# Altium schematic sheet Sync Demod.SchDoc: Sync Demod
size OrCAD A; DocumentNumber: LM-003; Revision: 3.0; SheetNumber: 5; SheetTotal: 11
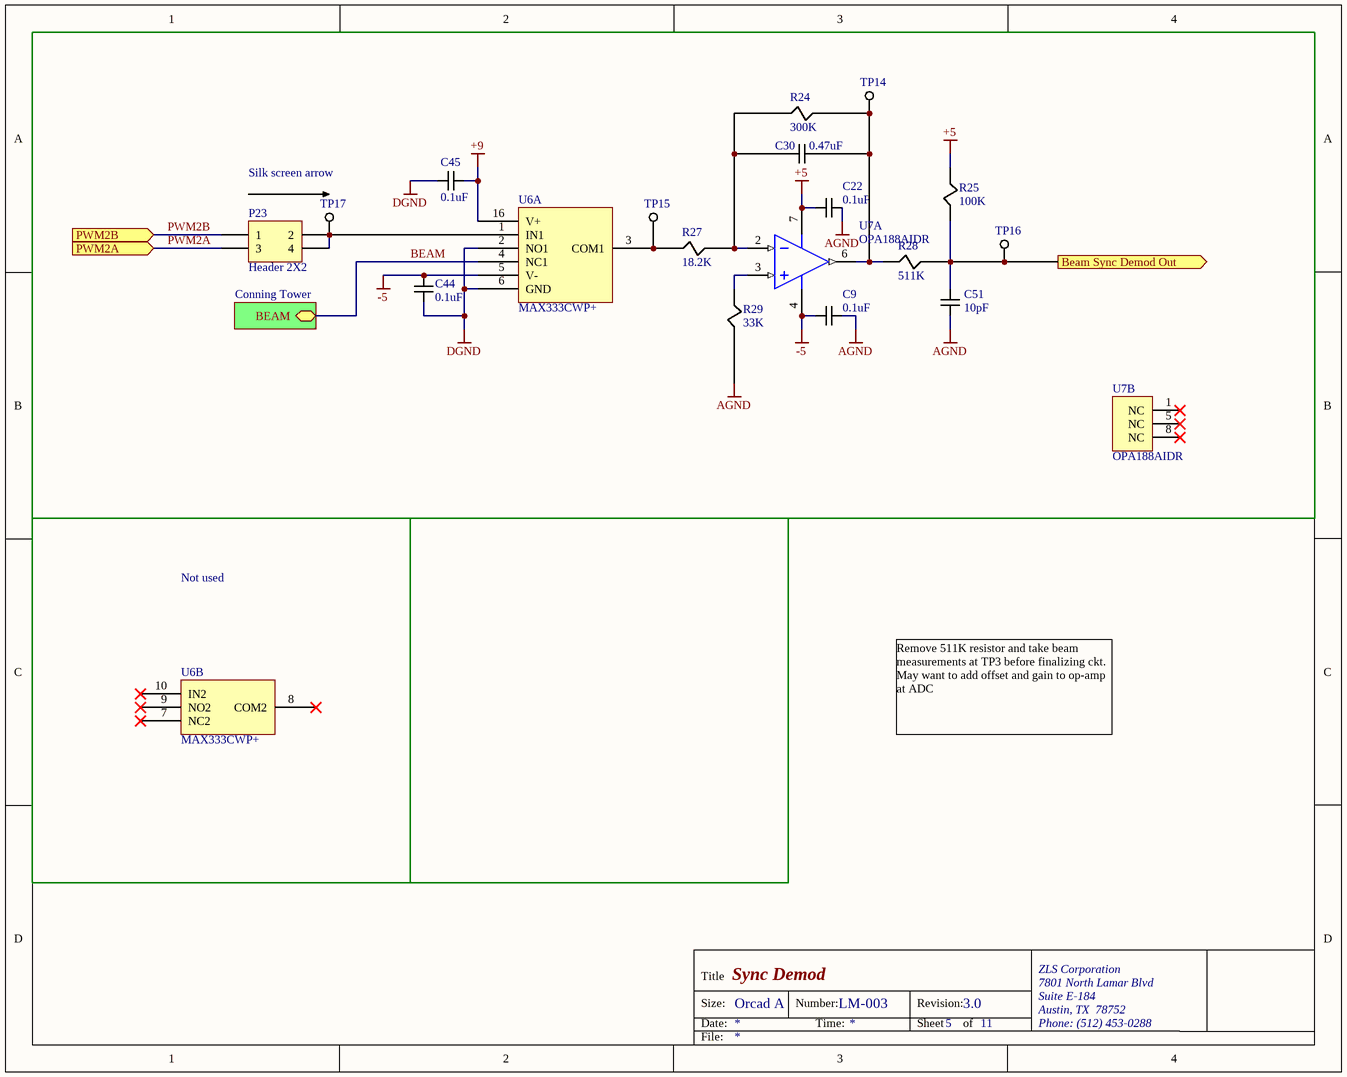
[diagram p0: Sync Demod.SchDoc]

## Parts
(Parts that share a designator on the sheet are numbered #1, #2 ... from top to bottom, then left to right.)
C9  0.1uF
C22  0.1uF
C30  0.47uF
C44  0.1uF
C45  0.1uF
C51  10pF
P23  Header 2X2  [HDR2X2]
R24  300K  [0805]
R25  100K  [0805]
R27  18.2K  [0805]
R28  511K  [0805]
R29  33K  [0805]
TP14  (no value)
TP15  (no value)
TP16  (no value)
TP17  (no value)
U6  MAX333CWP+  (parts A,B of 4)
U7#1  OPA188AIDR  [D0008A_M]  (part A of 2)
U7#2  OPA188AIDR  [D0008A_M]  (part B of 2)

## Blocks framed on the sheet
Silk screen arrow: C9 C22 C30 C44 C45 C51 P23 R24 R25 R27-R29 TP14-TP17 U6 U7#1 U7#2
Not used: U6

## Sub-sheets
Conning Tower = Connectors.SchDoc: BEAM

## Ports
Beam Sync Demod Out (out), PWM2A (in), PWM2B (in)

## Nets
+5: C22.1 R25.2 U7#1.7(V+)
+9: C45.2 U6.16(V+)
-5: C9.1 C44.1 U6.5(V-) U7#1.4(V-)
AGND: C9.2 C22.2 C51.2 R29.1
DGND: C44.2 C45.1 U6.2(NO1) U6.6(GND)
BEAM: U6.4(NC1) ; sheet Conning Tower/BEAM
Beam Sync Demod Out: C51.1 R25.1 R28.2 TP16.1 ; port Beam Sync Demod Out
PWM2A: P23.3 ; port PWM2A
PWM2B: P23.1 ; port PWM2B
NetC30_1: C30.1 R24.1 R27.2 U7#1.2(IN-)
NetC30_2: C30.2 R24.2 R28.1 TP14.1 U7#1.6(OUT)
NetP23_2: P23.2 P23.4 TP17.1 U6.1(IN1)
NetR27_1: R27.1 TP15.1 U6.3(COM1)
NetR29_2: R29.2 U7#1.3(IN+)

Not connected (* = marked no-connect by the designer): U6 7(NC2)* 8(COM2)* 9(NO2)* 10(IN2)*; U7#2 1(NC)* 5(NC)* 8(NC)*

## Notes on the sheet
- Remove 511K resistor and take beam measurements at TP3 before finalizing ckt.
  May want to add offset and gain to op-amp at ADC
- Title
- Size:
- Date:
- Orcad A
- Number:
- Time:
- Revision:
- Sheet
- of
- ZLS Corporation
- 7801 North Lamar Blvd
- Suite E-184
- Austin, TX  78752
- Phone: (512) 453-0288
- File:

## Library data of the parts
C9 C22 C44 C45 = CAP B: CAP CER 0.1UF 25V X7R 0805; Manufacturer 1: Murata Electronics North America; Manufacturer Part Number 1: GRM21BR71E104KA01L; Category 1: Capacitors; Capacitance: 0.1µF; Tolerance: ±10%; Supplier 1: Digi-Key; Supplier Part Number 1: 490-1673-1-ND; RoHS 1: RoHS Compliant; Description 1: CAP CER 0.1UF 25V X7R 0805; Stock 1: 897437; Pricing 1: 1=0.2, 10=0.145, 25=0.106, 50=0.0824, 100=0.0683, 250=0.05652, 500=0.04788, 1000=0.03964 (USD); Packaging: Cut Tape (CT); Part Status: Active; Voltage - Rated: 25V; Temperature Coefficient: X7R; Operating Temperature: -55°C ~ 125°C; Features: -; Ratings: -; Applications: General Purpose; Mounting Type: Surface Mount, MLCC; Package / Case: 0805 (2012 Metric); Size / Dimension: 0.079" L x 0.049" W (2.00mm x 1.25mm); Height - Seated (Max): -; Thickness (Max): 0.053" (1.35mm); Lead Spacing: -; Lead Style: -; ComponentLink1URL: http://www.murata.com/~/media/webrenewal/support/library/catalog/products/capacitor/mlcc/c02e.ashx; ComponentLink1Description: http://www.murata.com/~/media/webrenewal/support/library/catalog/products/capacitor/mlcc/c02e.ashx
C30 = CAP B: CAP CER 0.47UF 25V X7R 0805; Manufacturer 1: Murata Electronics North America; Manufacturer Part Number 1: GRM219R71E474KA88D; Category 1: Capacitors; Capacitance: 0.47µF; Tolerance: ±10%; Supplier 1: Digi-Key; Supplier Part Number 1: 490-11584-1-ND; RoHS 1: RoHS Compliant; Description 1: CAP CER 0.47UF 25V X7R 0805; Stock 1: 32625; Pricing 1: 1=0.31, 10=0.219, 25=0.1792, 50=0.153, 100=0.1311, 250=0.10924, 500=0.09832, 1000=0.08303 (USD); Packaging: Cut Tape (CT); Part Status: Active; Voltage - Rated: 25V; Temperature Coefficient: X7R; Operating Temperature: -55°C ~ 125°C; Features: -; Ratings: -; Applications: General Purpose; Mounting Type: Surface Mount, MLCC; Package / Case: 0805 (2012 Metric); Size / Dimension: 0.079" L x 0.049" W (2.00mm x 1.25mm); Height - Seated (Max): -; Thickness (Max): 0.037" (0.95mm); Lead Spacing: -; Lead Style: -; ComponentLink1URL: http://www.murata.com/~/media/webrenewal/support/library/catalog/products/capacitor/mlcc/c02e.ashx; ComponentLink1Description: http://www.murata.com/~/media/webrenewal/support/library/catalog/products/capacitor/mlcc/c02e.ashx
C51 = CAP B: CAP CER 10PF 200V C0G/NP0 0805; Manufacturer 1: Murata Electronics North America; Manufacturer Part Number 1: GRM21A5C2D100JW01D; Category 1: Capacitors; Tolerance: ±5%; Temperature Coefficient: C0G, NP0; Supplier 1: Digi-Key; Supplier Part Number 1: 490-14649-1-ND; RoHS 1: RoHS Compliant; Description 1: CAP CER 10PF 200V C0G/NP0 0805; Stock 1: 1350; Pricing 1: 1=0.29, 10=0.196, 25=0.1436, 50=0.1174, 100=0.0991, 250=0.08084, 500=0.06782, 1000=0.05999 (USD); Part Status: Active; Capacitance: 10pF; Voltage - Rated: 200V; Operating Temperature: -55°C ~ 125°C; Features: -; Ratings: -; Applications: General Purpose; Failure Rate: -; Mounting Type: Surface Mount, MLCC; Package / Case: 0805 (2012 Metric); Size / Dimension: 0.079" L x 0.049" W (2.00mm x 1.25mm); Height - Seated (Max): -; Thickness (Max): 0.039" (1.00mm); Lead Spacing: -; Lead Style: -; ComponentLink1URL: http://search.murata.co.jp/Ceramy/image/img/A01X/G101/ENG/GRM21A5C2D100JW01-01.pdf; ComponentLink1Description: http://search.murata.co.jp/Ceramy/image/img/A01X/G101/ENG/GRM21A5C2D100JW01-01.pdf
P23 = Header 2X2: Header, 2-Pin, Dual row; Manufacturer 1: TE Connectivity AMP Connectors; Manufacturer Part Number 1: 1-87215-0; Description 1: CONN HEADER VERT 2POS .100 30AU; Category 1: Connectors, Interconnects; Style: Board to Board or Cable; Shrouding: Unshrouded; Number of Positions: 2; Number of Positions Loaded: All; Row Spacing - Mating: 0.100" (2.54mm); Contact Length - Mating: 0.318" (8.08mm); Contact Length - Post: 0.125" (3.18mm); Overall Contact Length: 0.533" (13.55mm); Material Flammability Rating: UL94 V-0; Current Rating: 3A; Supplier 1: Digi-Key; Supplier Part Number 1: A26564-ND; RoHS 1: RoHS Compliant; Stock 1: 9703; Pricing 1: 1=1.42, 10=1.287, 50=1.1554, 100=1.1029, 250=0.99784, 500=0.91906, 1000=0.78777, 2500=0.73525 (USD); Packaging: Bulk; Part Status: Active; Connector Type: Header; Contact Type: Male Pin; Pitch - Mating: -; Number of Rows: 2; Mounting Type: Through Hole; Termination: Solder; Fastening Type: Push-Pull; Insulation Height: 0.090" (2.29mm); Contact Shape: Circular; Contact Finish - Mating: Gold; Contact Finish Thickness - Mating: 30µin (0.76µm); Contact Finish - Post: Gold; Contact Material: Phosphor Bronze; Insulation Material: Thermoplastic; Features: -; Operating Temperature: -65°C ~ 105°C; Ingress Protection: -; Insulation Color: Black; Voltage Rating: -; Mated Stacking Heights: -; Contact Finish Thickness - Post: Flash; Applications: -; ComponentLink1URL: http://www.te.com/commerce/DocumentDelivery/DDEController?Action=srchrtrv&DocNm=87215&DocType=Customer+Drawing&DocLang=English; ComponentLink1Description: http://www.te.com/commerce/DocumentDelivery/DDEController?Action=srchrtrv&DocNm=87215&DocType=Customer+Drawing&DocLang=English
R24 = RES1: RES SMD 300K OHM 1% 1/8W 0805; Manufacturer 1: Vishay Dale; Manufacturer Part Number 1: CRCW0805300KFKEA; Category 1: Resistors; Power (Watts): 0.125W, 1/8W; Temperature Coefficient: ±100ppm/°C; Supplier 1: Digi-Key; Supplier Part Number 1: 541-300KCDKR-ND; RoHS 1: RoHS Compliant; Description 1: RES SMD 300K OHM 1% 1/8W 0805; Stock 1: 30792; Pricing 1: 1=0.1, 10=0.042, 25=0.0304, 50=0.0232, 100=0.017, 250=0.013, 500=0.0104, 1000=0.00765 (USD); Packaging: Digi-Reel®; Part Status: Active; Resistance (Ohms): 300k; Tolerance: ±1%; Composition: Thick Film; Features: Automotive AEC-Q200; Operating Temperature: -55°C ~ 155°C; Package / Case: 0805 (2012 Metric); Supplier Device Package: 0805; Size / Dimension: 0.079" L x 0.049" W (2.00mm x 1.25mm); Height - Seated (Max): 0.020" (0.50mm); Failure Rate: -; ComponentLink1URL: http://www.vishay.com/docs/20035/dcrcwe3.pdf; ComponentLink1Description: http://www.vishay.com/docs/20035/dcrcwe3.pdf
R25 = RES1: RES SMD 100K OHM 1% 1/8W 0805; Manufacturer 1: Vishay Dale; Manufacturer Part Number 1: CRCW0805100KFKEA; Category 1: Resistors; Power (Watts): 0.125W, 1/8W; Temperature Coefficient: ±100ppm/°C; Supplier 1: Digi-Key; Supplier Part Number 1: 541-100KCCT-ND; RoHS 1: RoHS Compliant; Description 1: RES SMD 100K OHM 1% 1/8W 0805; Stock 1: 231934; Pricing 1: 1=0.1, 10=0.042, 25=0.0304, 50=0.0232, 100=0.017, 250=0.013, 500=0.0104, 1000=0.00765 (USD); Packaging: Cut Tape (CT); Part Status: Active; Resistance (Ohms): 100k; Tolerance: ±1%; Composition: Thick Film; Features: Automotive AEC-Q200; Operating Temperature: -55°C ~ 155°C; Package / Case: 0805 (2012 Metric); Supplier Device Package: 0805; Size / Dimension: 0.079" L x 0.049" W (2.00mm x 1.25mm); Height - Seated (Max): 0.020" (0.50mm); Failure Rate: -; ComponentLink1URL: http://www.vishay.com/docs/20035/dcrcwe3.pdf; ComponentLink1Description: http://www.vishay.com/docs/20035/dcrcwe3.pdf
R27 = RES1: RES SMD 18.2K OHM 1% 1/8W 0805; Manufacturer 1: Vishay Dale; Manufacturer Part Number 1: CRCW080518K2FKEA; Category 1: Resistors; Power (Watts): 0.125W, 1/8W; Temperature Coefficient: ±100ppm/°C; Supplier 1: Digi-Key; Supplier Part Number 1: 541-18.2KCCT-ND; RoHS 1: RoHS Compliant; Description 1: RES SMD 18.2K OHM 1% 1/8W 0805; Stock 1: 1350; Pricing 1: 1=0.1, 10=0.042, 25=0.0304, 50=0.0232, 100=0.017, 250=0.013, 500=0.0104, 1000=0.00765 (USD); Packaging: Cut Tape (CT); Part Status: Active; Resistance (Ohms): 18.2k; Tolerance: ±1%; Composition: Thick Film; Features: Automotive AEC-Q200; Operating Temperature: -55°C ~ 155°C; Package / Case: 0805 (2012 Metric); Supplier Device Package: 0805; Size / Dimension: 0.079" L x 0.049" W (2.00mm x 1.25mm); Height - Seated (Max): 0.020" (0.50mm); Failure Rate: -; ComponentLink1URL: http://www.vishay.com/docs/20035/dcrcwe3.pdf; ComponentLink1Description: http://www.vishay.com/docs/20035/dcrcwe3.pdf
R28 = RES1: RES SMD 511K OHM 1% 1/8W 0805; Manufacturer 1: Vishay Dale; Manufacturer Part Number 1: CRCW0805511KFKEA; Category 1: Resistors; Power (Watts): 0.125W, 1/8W; Temperature Coefficient: ±100ppm/°C; Supplier 1: Digi-Key; Supplier Part Number 1: 541-511KCCT-ND; RoHS 1: RoHS Compliant; Description 1: RES SMD 511K OHM 1% 1/8W 0805; Stock 1: 7865; Pricing 1: 1=0.1, 10=0.042, 25=0.0304, 50=0.0232, 100=0.017, 250=0.013, 500=0.0104, 1000=0.00765 (USD); Packaging: Cut Tape (CT); Part Status: Active; Resistance (Ohms): 511k; Tolerance: ±1%; Composition: Thick Film; Features: Automotive AEC-Q200; Operating Temperature: -55°C ~ 155°C; Package / Case: 0805 (2012 Metric); Supplier Device Package: 0805; Size / Dimension: 0.079" L x 0.049" W (2.00mm x 1.25mm); Height - Seated (Max): 0.020" (0.50mm); Failure Rate: -; ComponentLink1URL: http://www.vishay.com/docs/20035/dcrcwe3.pdf; ComponentLink1Description: http://www.vishay.com/docs/20035/dcrcwe3.pdf
R29 = RES1: RES SMD 33K OHM 1% 1/8W 0805; Manufacturer 1: Vishay Dale; Manufacturer Part Number 1: CRCW080533K0FKEA; Category 1: Resistors; Power (Watts): 0.125W, 1/8W; Temperature Coefficient: ±100ppm/°C; Supplier 1: Digi-Key; Supplier Part Number 1: 541-33.0KCDKR-ND; RoHS 1: RoHS Compliant; Description 1: RES SMD 33K OHM 1% 1/8W 0805; Stock 1: 24473; Pricing 1: 1=0.1, 10=0.042, 25=0.0304, 50=0.0232, 100=0.017, 250=0.013, 500=0.0104, 1000=0.00765 (USD); Packaging: Digi-Reel®; Part Status: Active; Resistance (Ohms): 33k; Tolerance: ±1%; Composition: Thick Film; Features: Automotive AEC-Q200; Operating Temperature: -55°C ~ 155°C; Package / Case: 0805 (2012 Metric); Supplier Device Package: 0805; Size / Dimension: 0.079" L x 0.049" W (2.00mm x 1.25mm); Height - Seated (Max): 0.020" (0.50mm); Failure Rate: -; ComponentLink1URL: http://www.vishay.com/docs/20035/dcrcwe3.pdf; ComponentLink1Description: http://www.vishay.com/docs/20035/dcrcwe3.pdf
TP14-TP17 = TESTPOINT A: TEST POINT PC MINI .040"D BLACK; Manufacturer 1: Keystone Electronics; Manufacturer Part Number 1: 5001; Category 1: Test and Measurement; Plating: Silver; Material - Insulation: Nylon 46, UL 94V-0; Material - Body: Phosphor Bronze; Supplier 1: Digi-Key; Supplier Part Number 1: 36-5001-ND; RoHS 1: RoHS Compliant; Description 1: TEST POINT PC MINI .040"D BLACK; Stock 1: 883882; Pricing 1: 1=0.37, 10=0.316, 50=0.2298, 100=0.2209, 250=0.19832, 500=0.18932, 1000=0.1616, 2500=0.14424, 5000=0.13523 (USD); Packaging: Bulk; Part Status: Active; Type: PC Test Point, Miniature; Mounting Type: 0.040" (1.02mm) Hole Diameter; Color: Black; Size / Dimension: 0.100" Dia x 0.180" L (2.54mm x 4.57mm); Height: -; ComponentLink1URL: http://www.keyelco.com/product-pdf.cfm?p=1310; ComponentLink1Description: http://www.keyelco.com/product-pdf.cfm?p=1310
U7#1 U7#2 = CMP-0809-00004-2: Precision, Low Noise, Rail-to-Rail Output, Zero-Drift Operational Amplifier, 4 to 36 V, -40 to 125 degC, 8-pin SOIC (D8), Green (RoHS & no Sb/Br); Manufacturer: Texas Instruments; Iq per channel(Max)(mA): 0.51; SubFamily: Zero Drift Precision Amplifier; Total Supply Voltage(Max)(+5V is 5, +/-5V is 10): 36; CMRR(Min)(dB): 120; Total Supply Voltage(Min)(+5V is 5, +/-5V is 10): 4; Slew Rate(Typ)(V/us): 0.8; GBW(Typ)(MHz): 2; Offset Drift(Typ)(uV/C): 0.03; Number of Channels: 1; Rating: Catalog; Packing: LARGE T&R; ComponentLink2URL: http://www.ti.com/lit/ds/symlink/opa188.pdf; Eco-Plan: Green (RoHS & no Sb/Br); DatasheetVersion: SBOS642A; PartNumber: OPA188AIDR; ComponentLink3Description: Package Specification; PackageDescription: 8-Pin Plastic Small Outline, Body 4.9 x 3.9 mm, Pitch 1.27 mm; Code_JEDEC: MS-012; ComponentLink1Description: Manufacturer URL; PackageReference: D0008A; Mounting Technology: Surface Mount; PackageVersion: 4040047-3/M, 06/2011; ComponentLink3URL: http://www.ti.com/litv/pdf/msoi002j; ComponentLink2Description: Datasheet; ComponentLink1URL: http://www.ti.com/; PartId: 1